# EAGLE design synth-zodiac-scorpio-kbd-old (EAGLE 9.6.2)
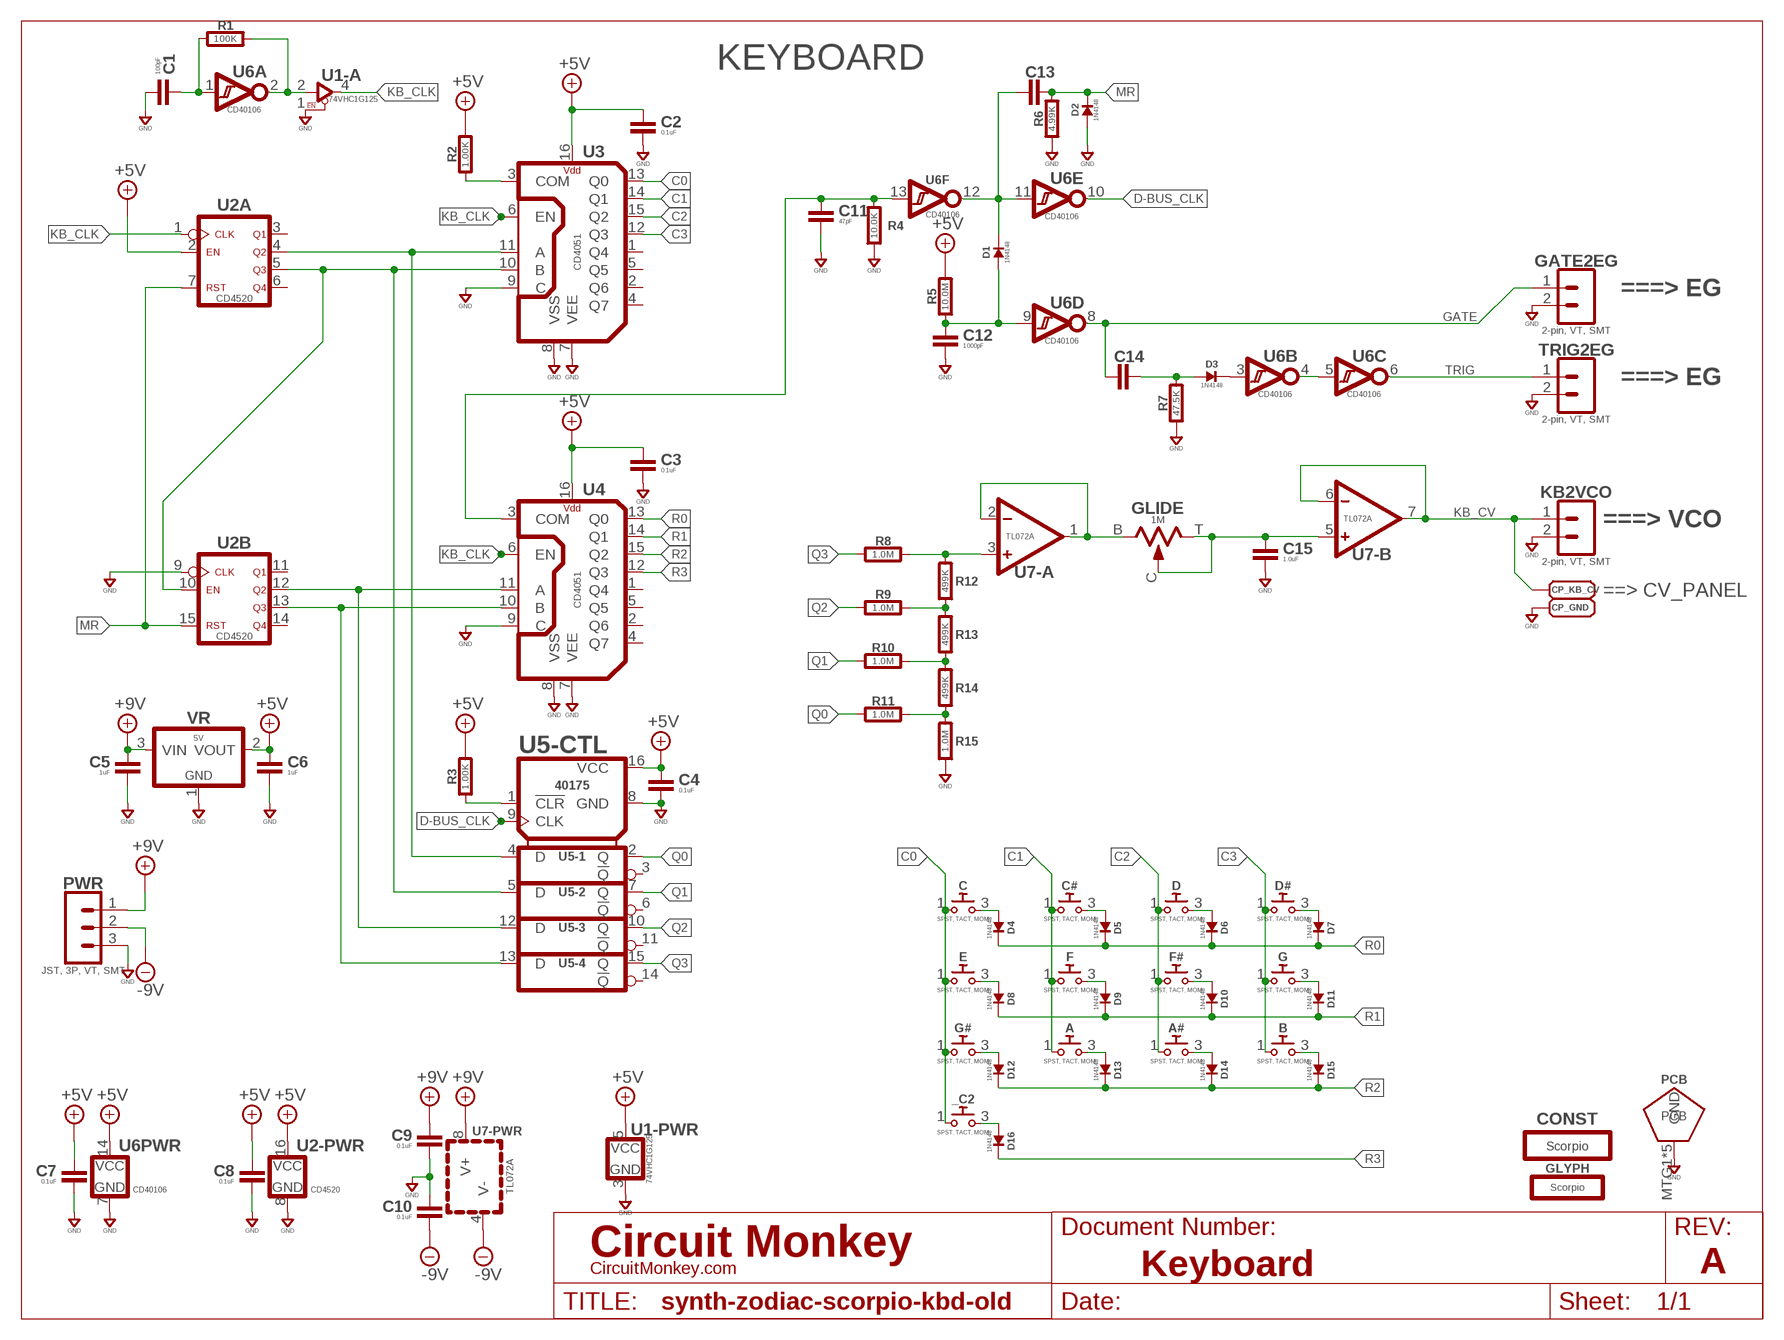
[diagram p0: schematic, sheet 1]
SHEET4 (LETTER_L-CIRCUITMONKEY): DOCUMENT_NUMBER: Keyboard; REV: A

## Parts
_C2  SPST, TACT, MOM  PUSHBTN-MOMB3FS-BLIND  [B3FS-BACKMOUNT]
A  SPST, TACT, MOM  PUSHBTN-MOMB3FS-BLIND  [B3FS-BACKMOUNT]
A#  SPST, TACT, MOM  PUSHBTN-MOMB3FS-BLIND  [B3FS-BACKMOUNT]
B  SPST, TACT, MOM  PUSHBTN-MOMB3FS-BLIND  [B3FS-BACKMOUNT]
C  SPST, TACT, MOM  PUSHBTN-MOMB3FS-BLIND  [B3FS-BACKMOUNT]
C1  100pF  CAPACITOR0603  [0603-CAP]
C2  0.1uF  CAPACITOR0603  [0603-CAP]
C3  0.1uF  CAPACITOR0603  [0603-CAP]
C4  0.1uF  CAPACITOR0603  [0603-CAP]
C5  1uF  CAPACITOR0603  [0603-CAP]
C6  1uF  CAPACITOR0603  [0603-CAP]
C7  0.1uF  CAPACITOR0603  [0603-CAP]
C8  0.1uF  CAPACITOR0603  [0603-CAP]
C9  0.1uF  CAPACITOR0603  [0603-CAP]
C10  0.1uF  CAPACITOR0603  [0603-CAP]
C11  47pF  CAPACITOR0603  [0603-CAP]
C12  1000pF  CAPACITOR0603  [0603-CAP]
C13  220pF  CAPACITOR0603  [0603-CAP]
C14  0.1uF  CAPACITOR0603  [0603-CAP]
C15  1.0uF  CAPACITOR0603  [0603-CAP]
C#  SPST, TACT, MOM  PUSHBTN-MOMB3FS-BLIND  [B3FS-BACKMOUNT]
CONST  Scorpio  CONSTELLATION-SCORPIO  [SCORPIO-CONST]
CP_GND  PAD-70X70SMD-070X070  [SMD-070MIL]
CP_KB_CV  PAD-70X70SMD-070X070  [SMD-070MIL]
D  SPST, TACT, MOM  PUSHBTN-MOMB3FS-BLIND  [B3FS-BACKMOUNT]
D1  1N4148  DIODE-1N4148  [SOD-123]
D2  1N4148  DIODE-1N4148  [SOD-123]
D3  1N4148  DIODE-1N4148  [SOD-123]
D4  1N4148  DIODE-1N4148  [SOD-123]
D5  1N4148  DIODE-1N4148  [SOD-123]
D6  1N4148  DIODE-1N4148  [SOD-123]
D7  1N4148  DIODE-1N4148  [SOD-123]
D8  1N4148  DIODE-1N4148  [SOD-123]
D9  1N4148  DIODE-1N4148  [SOD-123]
D10  1N4148  DIODE-1N4148  [SOD-123]
D11  1N4148  DIODE-1N4148  [SOD-123]
D12  1N4148  DIODE-1N4148  [SOD-123]
D13  1N4148  DIODE-1N4148  [SOD-123]
D14  1N4148  DIODE-1N4148  [SOD-123]
D15  1N4148  DIODE-1N4148  [SOD-123]
D16  1N4148  DIODE-1N4148  [SOD-123]
D#  SPST, TACT, MOM  PUSHBTN-MOMB3FS-BLIND  [B3FS-BACKMOUNT]
E  SPST, TACT, MOM  PUSHBTN-MOMB3FS-BLIND  [B3FS-BACKMOUNT]
F  SPST, TACT, MOM  PUSHBTN-MOMB3FS-BLIND  [B3FS-BACKMOUNT]
F#  SPST, TACT, MOM  PUSHBTN-MOMB3FS-BLIND  [B3FS-BACKMOUNT]
G  SPST, TACT, MOM  PUSHBTN-MOMB3FS-BLIND  [B3FS-BACKMOUNT]
G#  SPST, TACT, MOM  PUSHBTN-MOMB3FS-BLIND  [B3FS-BACKMOUNT]
GATE2EG  2-pin, VT, SMT  02PVT-SMT  [B2B-PH-SM4]
GLIDE  1M  TRIMPOT9MM_PCB_SHAFT  [POT-RV9110]
GLYPH  Scorpio  GLYPH-SCORPIO  [SCORPIO-GLYPH]
KB2VCO  2-pin, VT, SMT  02PVT-SMT  [B2B-PH-SM4]
PCB  PCB FAB  PENTAGON-40R  [PENTAGON-40MM-RAD]
PWR  JST, 3P, VT, SMT  03P-VT-SMT  [B3B-PH-SM4]
R1  100K  RESISTOR0603  [0603-RES]
R2  1.00K  RESISTOR0603  [0603-RES]
R3  1.00K  RESISTOR0603  [0603-RES]
R4  10.0K  RESISTOR0603  [0603-RES]
R5  10.0M  RESISTOR0603  [0603-RES]
R6  4.99K  RESISTOR0603  [0603-RES]
R7  47.5K  RESISTOR0603  [0603-RES]
R8  1.0M  RESISTOR0603  [0603-RES]
R9  1.0M  RESISTOR0603  [0603-RES]
R10  1.0M  RESISTOR0603  [0603-RES]
R11  1.0M  RESISTOR0603  [0603-RES]
R12  499K  RESISTOR0603  [0603-RES]
R13  499K  RESISTOR0603  [0603-RES]
R14  499K  RESISTOR0603  [0603-RES]
R15  1.0M  RESISTOR0603  [0603-RES]
TRIG2EG  2-pin, VT, SMT  02PVT-SMT  [B2B-PH-SM4]
U1  74VHC1G125  74VHC1G125CMOS-SOT553  [TSOP-5]
U2  CD4520  [SO16]
U3  CD4051  CD4051SO-D  [SO16]
U4  CD4051  CD4051SO-D  [SO16]
U5  40175  CD40175SMT-D-TYPE  [SO16]
U6  CD40106  CD40106-SOP14  [SOP14]
U7  TL072A  DUALTL072A  [SOP08]
VR  5V  LDO-3P--5V-SOT23  [SOT-23]

## Nets
+5V: C2.1 C3.1 C4.1 C6.1 C7.1 C8.1 R2.2 R3.2 R5.2 U1.5(-PWR:VCC) U2.2(A:EN) U2.16(-PWR:VCC) U3.16(VDD) U4.16(VDD) U5.16(-CTL:VCC) U6.14(PWR:VCC) VR.2(VOUT)
+9V: C5.1 C9.1 PWR.1 U7.8(-PWR:V+) VR.3(VIN)
-9V: C10.2 PWR.2 U7.4(-PWR:V-)
C0: _C2.1 C.1 E.1 G#.1 U3.13(Q0)
C1: A.1 C#.1 F.1 U3.14(Q1)
C2: A#.1 D.1 F#.1 U3.15(Q2)
C3: B.1 D#.1 G.1 U3.12(Q3)
D-BUS_CLK: U5.9(-CTL:CLK) U6.10(E:Y)
GATE: C14.1 GATE2EG.1 U6.8(D:Y)
GND: C1.2 C2.2 C3.2 C4.2 C5.2 C6.2 C7.2 C8.2 C9.2 C10.1 C11.2 C12.2 C15.2 CP_GND.1(PAD) D2.A GATE2EG.2 KB2VCO.2 PCB.MTG1(GND) PCB.MTG2(GND) PCB.MTG3(GND) PCB.MTG4(GND) PCB.MTG5(GND) PWR.3 R4.1 R6.1 R7.1 R15.1 TRIG2EG.2 U1.1(-A:!EN) U1.3(-PWR:GND) U2.8(-PWR:GND) U2.9(B:!CLK) U3.7(VEE) U3.8(VSS) U3.9(C) U4.7(VEE) U4.8(VSS) U4.9(C) U5.8(-CTL:GND) U6.7(PWR:GND) VR.1(GND)
KB_CLK: U1.4(-A:Y) U2.1(A:!CLK) U3.6(EN) U4.6(EN)
KB_CV: CP_KB_CV.1(PAD) KB2VCO.1 U7.6(-B:-) U7.7(-B:OUT)
MR: C13.2 D2.K R6.2 U2.7(A:RST) U2.15(B:RST)
N$78: R2.1 U3.3(COM)
N$102: C12.1 D1.A R5.1 U6.9(D:A)
N$103: R3.1 U5.1(-CTL:!CLR)
N$104: U6.4(B:Y) U6.5(C:A)
N$105: U2.12(B:Q2) U4.11(A) U5.12(-3:D)
N$106: U2.13(B:Q3) U4.10(B) U5.13(-4:D)
N$107: C1.1 R1.1 U6.1(A:A)
N$108: R1.2 U1.2(-A:A) U6.2(A:Y)
N$109: U2.4(A:Q2) U3.11(A) U5.4(-1:D)
N$110: U2.5(A:Q3) U2.10(B:EN) U3.10(B) U5.5(-2:D)
N$111: R11.2 R14.1 R15.2
N$112: C13.1 D1.K U6.11(E:A) U6.12(F:Y)
N$113: R10.2 R13.1 R14.2
N$114: D3.K U6.3(B:A)
N$115: C14.2 D3.A R7.2
N$116: C11.1 R4.2 U4.3(COM) U6.13(F:A)
N$117: R9.2 R12.1 R13.2
N$118: R8.2 R12.2 U7.3(-A:+)
N$119: GLIDE.B U7.1(-A:OUT) U7.2(-A:-)
N$120: C.3 D4.A
N$121: C15.1 GLIDE.C GLIDE.T U7.5(-B:+)
N$122: C#.3 D5.A
N$123: D6.A D.3
N$124: D7.A D#.3
N$125: D8.A E.3
N$126: D9.A F.3
N$127: D10.A F#.3
N$128: D11.A G.3
N$129: D12.A G#.3
N$130: A.3 D13.A
N$131: A#.3 D14.A
N$132: B.3 D15.A
N$133: _C2.3 D16.A
Q0: R11.1 U5.2(-1:Q)
Q1: R10.1 U5.7(-2:Q)
Q2: R9.1 U5.10(-3:Q)
Q3: R8.1 U5.15(-4:Q)
R0: D4.K D5.K D6.K D7.K U4.13(Q0)
R1: D8.K D9.K D10.K D11.K U4.14(Q1)
R2: D12.K D13.K D14.K D15.K U4.15(Q2)
R3: D16.K U4.12(Q3)
TRIG: TRIG2EG.1 U6.6(C:Y)
Unconnected: U2.3(A:Q1) U2.6(A:Q4) U2.11(B:Q1) U2.14(B:Q4) U3.1(Q4) U3.2(Q6) U3.4(Q7) U3.5(Q5) U4.1(Q4) U4.2(Q6) U4.4(Q7) U4.5(Q5) U5.3(-1:!Q) U5.6(-2:!Q) U5.11(-3:!Q) U5.14(-4:!Q)

## Notes on the sheet
- KEYBOARD
- ===> EG
- ===> EG
- ===> VCO
- ==> CV_PANEL

## Library data of the parts
_C2 A A# B C C# D D# E F F# G G# = switch-smd:PUSHBTN-MOM: Pushbutton Switch; COST01: 0.15; COST10: 0.12; COST100: 0.09; MFR: CK; MPN: B3FS; MPN2: Tayda A-3961(2.3mm), A-3959(1.4mm), A-3962
C1-C15 = rlc:CAPACITOR: Capacitor; COST01: 0.12; COST10: 0.09; COST100: 0.05
CONST = circuit-monkey-zodiac:CONSTELLATION: Constellations
CP_GND CP_KB_CV = con-testpoints:PAD-70X70: Solder Pad
D1-D16 = diodes:DIODE-: Diode; COST01: 0.20; COST10: 0.18; COST100: 0.10; MPN: 1N4148W
GATE2EG KB2VCO TRIG2EG = con-jst:02P: 2 pin connector; COST01: 0.76; COST10: 0.66; COST100: 0.56; MFR: JST; MPN: B2B-PH-SM4
GLIDE = rlc:TRIMPOT: Potentiometer; COST01: 0.70; COST10: 0.60; COST100: 0.60; MFR: Tayda; MPN: RV9110NO-OS15A00; SKU: A-5517
GLYPH = circuit-monkey-zodiac:GLYPH: Glyph
PCB = circuit-monkey-zodiac:PENTAGON: Pentagram shaped PCB
PWR = con-jst:03P: 3 pin connector; COST01: 0.60; COST10: 0.52; COST100: 0.43; MFR: JST; MPN: B3B-PH-SM4
R1-R15 = rlc:RESISTOR: Resistor; COST01: 0.10; COST10: 0.05; COST100: 0.02
U1 = logic:74VHC1G*125: Single Gate Buffer with Enable; COST01: 0.50; COST10: 0.40; COST100: 0.30; MFR: ON Semi; MPN: MC74VHC1G125P5TG
U2 = logic:CD4520: Up Counter, 4-bit, Dual; COST01: 0.60; COST10: 0.50; COST100: 0.35; MFR: TI; MPN: CD4520BM96
U3 U4 = logic:CD4051: 8-channel, Multiplexer/Demultiplexer; COST01: 0.70; COST10: 0.60; COST100: 0.40; MFR: TI; MPN: CD4051BM
U5 = logic:CD40175: Quad D-type Flip Flop; COST01: 0.60; COST10: 0.50; COST100: 0.37; MFR: TI; MPN: CD40175BM
U6 = logic:CD40106: Hex Inverting Schmidt Trigger Buffer; COST01: 0.64; COST10: 0.54; COST100: 0.39; MFR: TI; MPN: CD40106BM
U7 = op-amp:DUAL: Dual Op-Amp; COST01: 0.65; COST10: 0.55; COST100: 0.45; MFR: ST; MPN: TL072A
VR = regulators:LDO-3P-: regulator 3-pin; COST01: 0.66; COST10: 0.56; COST100: 0.39; MFR: Diodes, Inc.; MPN: AP7387-50SA

## Board
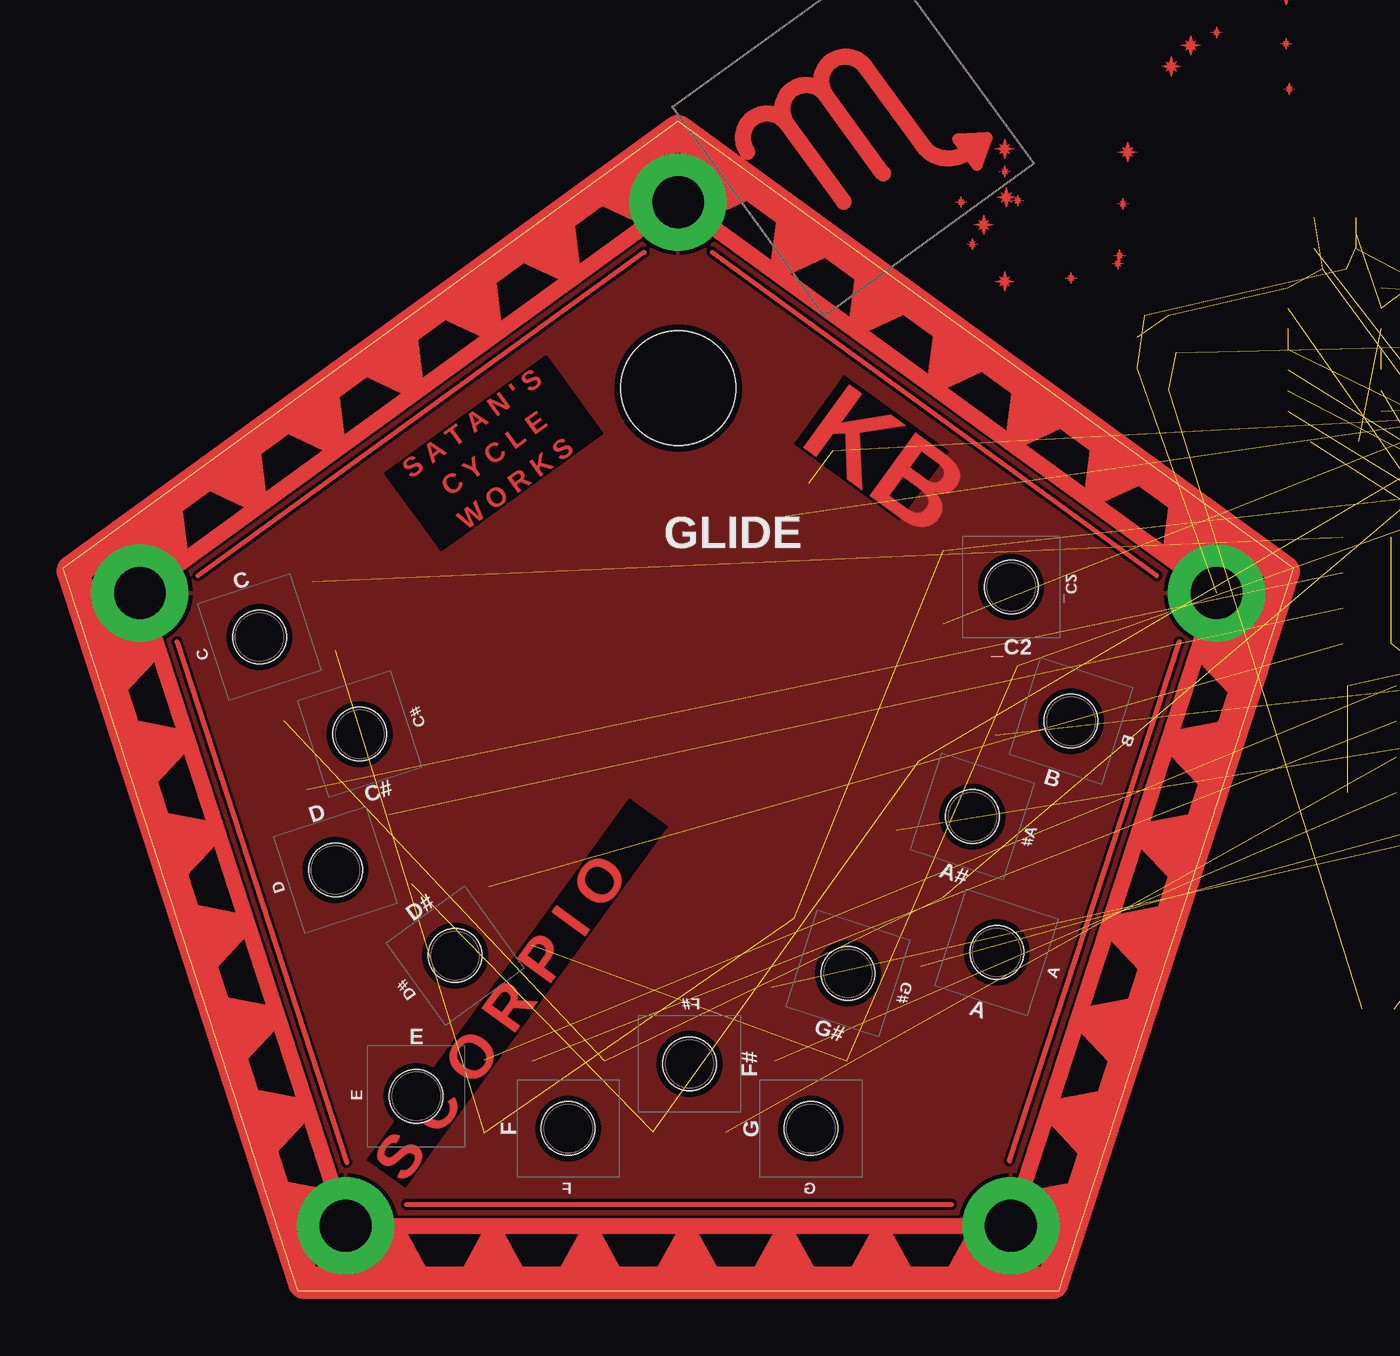
[diagram p1: board, top side]
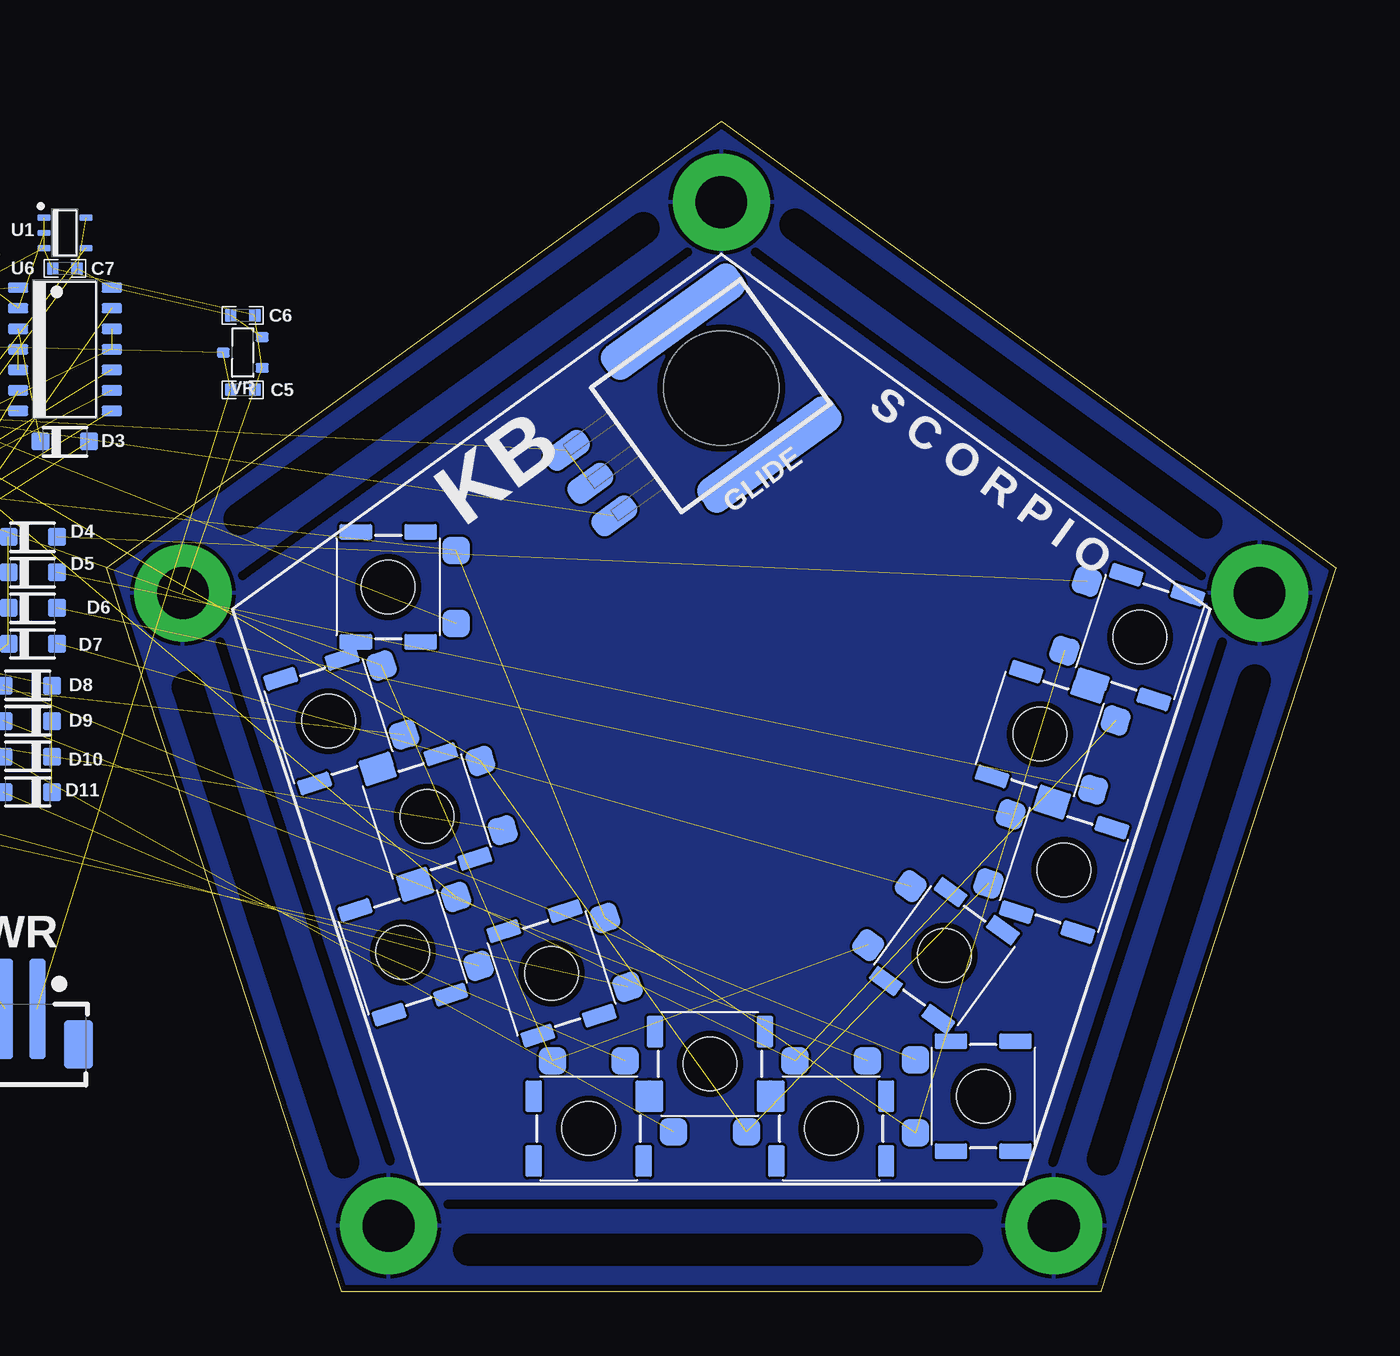
[diagram p2: board, bottom side, seen from below]

Size 76.08 x 72.36 mm. Coordinates in mm from the lower left corner, seen from the top.
Copper layers (1*16): Top 0.0356mm / dielectric 1.5011mm / Bottom 0.0356mm
Design rules "OSH-CircuitMonkey *": minimum track width 6mil, minimum drill 12mil, track to track 6mil, track to pad 6mil, pad to pad 6mil, via to via 6mil, smd to smd 6mil, copper to edge 15mil, drill to drill 6mil, minimum pad ring 7mil, minimum via ring 7mil, stop-mask expansion 3mil, vias tented up to drill 15mil, thermal gap 10mil

### Footprints (pad centres in the part's own frame; a part is rotated, then mirrored left to right if it is on the bottom)
B3FS-BACKMOUNT = smd 1.7 x 1.7 bottom: 1 4.2,-2.25; 3 4.2,2.25 | smd 2 x 1 bottom: MT1 -2,3.4; MT2 2,3.4; MT3 -2,-3.4; MT4 2,-3.4 | hole 3.3: 0,0
0603-CAP = smd 0.711 x 0.762: 1 -0.752,0; 2 0.752,0
SMD-070MIL = smd 1.778 x 1.778: 1 0.508,0
SOD-123 = smd 1.1 x 1.1: A 1.5,0; K -1.5,0
B2B-PH-SM4 = smd 1 x 6.2: 1 -1,-2.2; 2 1,-2.2 | smd 1.8 x 3: GND@MT1 3.55,0; GND@MT2 -3.55,0
POT-RV9110 = smd 1.6 x 3: B 2.5,-10; C 0,-10; T -2.5,-10 | smd 2.286 x 10.16: MNT1 -5.08,0; MNT2 5.08,0 | hole 7.1: 0,0
PENTAGON-40MM-RAD = drill 3.2 pad 6: MTG1 0,35; MTG2 33.3,10.82; MTG3 20.57,-28.32; MTG4 -20.57,-28.32; MTG5 -33.3,10.82
B3B-PH-SM4 = smd 1 x 6.2: 1 -2,-2.2; 2 0,-2.2; 3 2,-2.2 | smd 1.8 x 3: GND@MT1 4.55,0; GND@MT2 -4.55,0
0603-RES = smd 0.711 x 0.762: 1 -0.752,0; 2 0.752,0
TSOP-5 = smd 0.4 x 0.8: 1 -0.95,-1.3; 2 0,-1.3; 3 0.95,-1.3; 4 0.95,1.3; 5 -0.95,1.3
SO16 = smd 0.6 x 1.4: 1 -4.445,-2.9; 2 -3.175,-2.9; 3 -1.905,-2.9; 4 -0.635,-2.9; 5 0.635,-2.9; 6 1.905,-2.9; 7 3.175,-2.9; 8 4.445,-2.9; 9 4.445,2.9; 10 3.175,2.9; 11 1.905,2.9; 12 0.635,2.9; 13 -0.635,2.9; 14 -1.905,2.9; 15 -3.175,2.9; 16 -4.445,2.9
SOP14 = smd 1.27 x 0.635: 1 -2.9,3.81; 2 -2.9,2.54; 3 -2.9,1.27; 4 -2.9,0; 5 -2.9,-1.27; 6 -2.9,-2.54; 7 -2.9,-3.81; 8 2.9,-3.81; 9 2.9,-2.54; 10 2.9,-1.27; 11 2.9,0; 12 2.9,1.27; 13 2.9,2.54; 14 2.9,3.81
SOP08 = smd 0.6 x 1.3: 1 -1.905,-2.85; 2 -0.635,-2.85; 3 0.635,-2.85; 4 1.905,-2.85; 5 1.905,2.85; 6 0.635,2.85; 7 -0.635,2.85; 8 -1.905,2.85
SOT-23 = smd 0.6 x 0.8: 1 0.95,1.2; 2 -0.95,1.2; 3 0,-1.2

### Placement (x,y rotation side)
_C2  58.64,43.56 180 top
A  57.74,20.96 162 top
A#  56.24,29.36 162 top
B  62.34,35.26 162 top
C  12.14,40.46 18 top
C1  84.04,61.96 180 bottom  (outside the outline)
C2  86.84,54.66 0 bottom  (outside the outline)
C3  87.24,42.76 180 bottom  (outside the outline)
C4  97.74,54.66 0 bottom  (outside the outline)
C5  67.64,55.76 0 bottom
C6  67.64,60.36 0 bottom
C7  78.64,63.26 180 bottom
C8  98.44,42.76 180 bottom  (outside the outline)
C9  108.54,60.46 180 bottom  (outside the outline)
C10  108.74,53.66 180 bottom  (outside the outline)
C11  108.44,45.66 0 bottom  (outside the outline)
C12  108.44,35.16 0 bottom  (outside the outline)
C13  108.44,41.96 0 bottom  (outside the outline)
C14  108.44,33.86 0 bottom  (outside the outline)
C15  105.84,53.66 0 bottom  (outside the outline)
C#  18.34,34.46 198 top
CONST  66.74,75.76 90 top  (outside the outline)
CP_GND  96.74,62.06 0 bottom  (outside the outline)
CP_KB_CV  97.14,59.86 0 bottom  (outside the outline)
D  16.84,26.06 18 top
D1  107.04,40.26 0 bottom  (outside the outline)
D2  107.04,38.26 0 bottom  (outside the outline)
D3  78.64,52.56 0 bottom
D4  80.64,46.66 0 bottom  (outside the outline)
D5  80.64,44.46 0 bottom  (outside the outline)
D6  80.64,42.26 0 bottom  (outside the outline)
D7  80.64,40.06 0 bottom  (outside the outline)
D8  80.94,37.46 180 bottom  (outside the outline)
D9  80.94,35.26 180 bottom  (outside the outline)
D10  80.94,33.06 180 bottom  (outside the outline)
D11  80.94,30.86 180 bottom  (outside the outline)
D12  113.04,34.06 0 bottom  (outside the outline)
D13  113.04,36.16 0 bottom  (outside the outline)
D14  113.04,38.26 0 bottom  (outside the outline)
D15  113.04,40.36 0 bottom  (outside the outline)
D16  108.64,62.16 0 bottom  (outside the outline)
D#  24.24,20.76 36 top
E  21.84,12.06 0 top
F  31.24,10.06 90 top
F#  38.74,14.06 270 top
G  46.24,10.06 90 top
G#  48.54,19.66 162 top
GATE2EG  95.94,18.26 108 bottom  (outside the outline)
GLIDE  38.04,55.86 306 bottom
GLYPH  48.94,71.56 36 top
KB2VCO  114.24,25.76 108 bottom  (outside the outline)
PCB  38.04,32.36 0 top
PWR  82.34,15.26 180 bottom
R1  84.04,63.26 180 bottom  (outside the outline)
R2  89.64,54.66 0 bottom  (outside the outline)
R3  100.54,54.66 0 bottom  (outside the outline)
R4  108.44,44.36 180 bottom  (outside the outline)
R5  108.44,36.46 0 bottom  (outside the outline)
R6  105.64,41.96 180 bottom  (outside the outline)
R7  105.64,33.86 180 bottom  (outside the outline)
R8  107.14,51.66 180 bottom  (outside the outline)
R9  107.14,50.26 180 bottom  (outside the outline)
R10  107.14,48.96 180 bottom  (outside the outline)
R11  107.14,47.66 180 bottom  (outside the outline)
R12  110.14,51.66 0 bottom  (outside the outline)
R13  110.14,50.26 0 bottom  (outside the outline)
R14  110.14,48.96 0 bottom  (outside the outline)
R15  110.14,47.66 0 bottom  (outside the outline)
TRIG2EG  104.54,21.26 108 bottom  (outside the outline)
U1  78.64,65.46 270 bottom
U2  99.24,36.86 270 bottom  (outside the outline)
U3  88.24,48.66 270 bottom  (outside the outline)
U4  88.24,36.86 270 bottom  (outside the outline)
U5  99.24,48.66 270 bottom  (outside the outline)
U6  78.64,58.26 0 bottom
U7  108.74,57.06 270 bottom  (outside the outline)
VR  67.64,58.06 270 bottom

### Tracks (layer width: path | path; a pad name or v marks a point on that pad's centre or on a via)
+5V  (16 unrouted)
+9V  (4 unrouted)
-9V  (2 unrouted)
C0  (4 unrouted)
C1  (3 unrouted)
C2  (3 unrouted)
C3  (3 unrouted)
D-BUS_CLK  (1 unrouted)
GATE  (2 unrouted)
GND  (36 unrouted)
  pour Top (rank 4): 17.44,3.96 58.64,3.96 71.44,43.16 38.04,67.56 4.64,43.16
  pour Bottom: 14.64,0.16 61.44,0.16 75.84,44.56 75.84,44.76 38.04,72.16 0.24,44.76 0.24,44.36
KB_CLK  (3 unrouted)
KB_CV  (3 unrouted)
MR  (4 unrouted)
N$78  (1 unrouted)
N$102  (3 unrouted)
N$103  (1 unrouted)
N$104  (1 unrouted)
N$105  (2 unrouted)
N$106  (2 unrouted)
N$107  (2 unrouted)
N$108  (2 unrouted)
N$109  (2 unrouted)
N$110  (3 unrouted)
N$111  (2 unrouted)
N$112  (3 unrouted)
N$113  (2 unrouted)
N$114  (1 unrouted)
N$115  (2 unrouted)
N$116  (3 unrouted)
N$117  (2 unrouted)
N$118  (2 unrouted)
N$119  (2 unrouted)
N$120  (1 unrouted)
N$121  (3 unrouted)
N$122  (1 unrouted)
N$123  (1 unrouted)
N$124  (1 unrouted)
N$125  (1 unrouted)
N$126  (1 unrouted)
N$127  (1 unrouted)
N$128  (1 unrouted)
N$129  (1 unrouted)
N$130  (1 unrouted)
N$131  (1 unrouted)
N$132  (1 unrouted)
N$133  (1 unrouted)
Q0  (1 unrouted)
Q1  (1 unrouted)
Q2  (1 unrouted)
Q3  (1 unrouted)
R0  (4 unrouted)
R1  (4 unrouted)
R2  (4 unrouted)
R3  (1 unrouted)
TRIG  (1 unrouted)

### Text on the board
Top: S A T A N ' S / C Y C L E / W O R K S | KB | S C O R P I O
bPlace: S C O R P I O | KB
tStop: S A T A N ' S / C Y C L E / W O R K S | KB | S C O R P I O